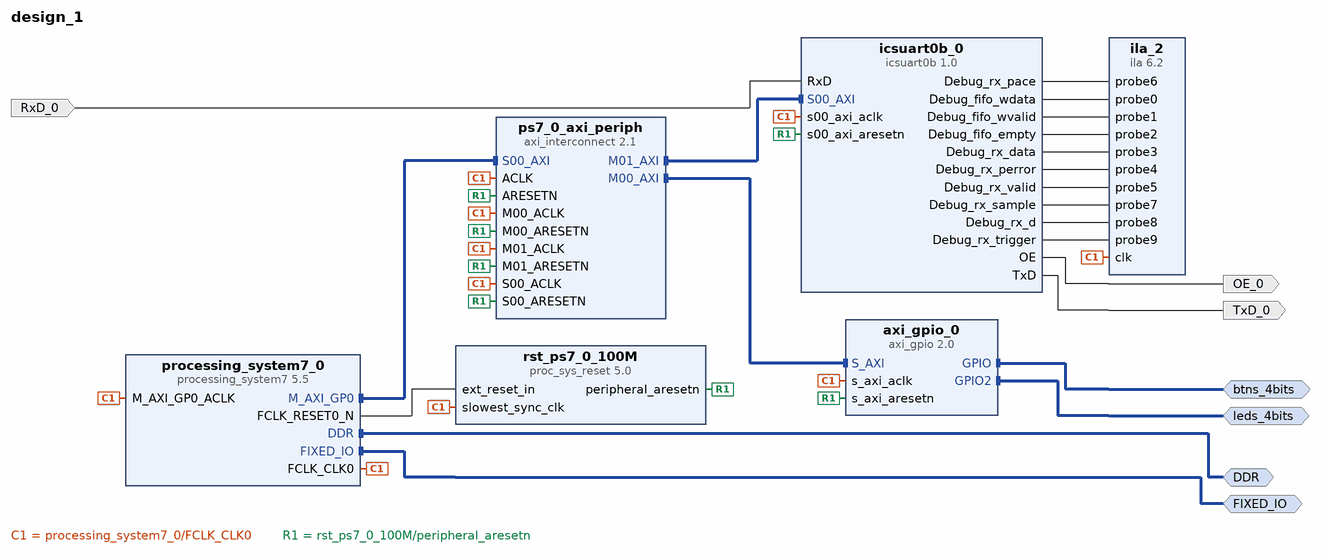
[diagram p0: block diagram of the top level]
# Vivado block design design_1, xc7z010clg400-1, Vivado 2018.3
create_bd_design design_1

create_bd_intf_port -mode Master -vlnv xilinx.com:interface:ddrx_rtl:1.0 DDR
create_bd_intf_port -mode Master -vlnv xilinx.com:display_processing_system7:fixedio_rtl:1.0 FIXED_IO
create_bd_intf_port -mode Master -vlnv xilinx.com:interface:gpio_rtl:1.0 btns_4bits
create_bd_intf_port -mode Master -vlnv xilinx.com:interface:gpio_rtl:1.0 leds_4bits
create_bd_port -dir O TxD_0
create_bd_port -dir O OE_0
create_bd_port -dir I RxD_0

create_bd_cell -type ip -vlnv xilinx.com:ip:processing_system7:5.5 processing_system7_0
set_property -dict [list \
  CONFIG.PCW_APU_PERIPHERAL_FREQMHZ 650 \
  CONFIG.PCW_CRYSTAL_PERIPHERAL_FREQMHZ 50.000000 \
  CONFIG.PCW_ENET0_ENET0_IO {MIO 16 .. 27} \
  CONFIG.PCW_ENET0_GRP_MDIO_ENABLE 1 \
  CONFIG.PCW_ENET0_GRP_MDIO_IO {MIO 52 .. 53} \
  CONFIG.PCW_ENET0_PERIPHERAL_ENABLE 1 \
  CONFIG.PCW_ENET0_RESET_ENABLE 0 \
  CONFIG.PCW_ENET_RESET_ENABLE 1 \
  CONFIG.PCW_ENET_RESET_SELECT {Share reset pin} \
  CONFIG.PCW_FPGA0_PERIPHERAL_FREQMHZ 100 \
  CONFIG.PCW_FPGA1_PERIPHERAL_FREQMHZ 50 \
  CONFIG.PCW_GP0_EN_MODIFIABLE_TXN 0 \
  CONFIG.PCW_GP1_EN_MODIFIABLE_TXN 0 \
  CONFIG.PCW_GPIO_MIO_GPIO_ENABLE 1 \
  CONFIG.PCW_GPIO_MIO_GPIO_IO MIO \
  CONFIG.PCW_I2C_RESET_ENABLE 1 \
  CONFIG.PCW_PERIPHERAL_BOARD_PRESET part0 \
  CONFIG.PCW_PRESET_BANK1_VOLTAGE {LVCMOS 1.8V} \
  CONFIG.PCW_QSPI_GRP_FBCLK_ENABLE 1 \
  CONFIG.PCW_QSPI_GRP_FBCLK_IO {MIO 8} \
  CONFIG.PCW_QSPI_GRP_SINGLE_SS_ENABLE 1 \
  CONFIG.PCW_QSPI_GRP_SINGLE_SS_IO {MIO 1 .. 6} \
  CONFIG.PCW_QSPI_PERIPHERAL_ENABLE 1 \
  CONFIG.PCW_QSPI_QSPI_IO {MIO 1 .. 6} \
  CONFIG.PCW_SD0_GRP_CD_ENABLE 1 \
  CONFIG.PCW_SD0_GRP_CD_IO {MIO 47} \
  CONFIG.PCW_SD0_GRP_WP_ENABLE 1 \
  CONFIG.PCW_SD0_GRP_WP_IO EMIO \
  CONFIG.PCW_SD0_PERIPHERAL_ENABLE 1 \
  CONFIG.PCW_SD0_SD0_IO {MIO 40 .. 45} \
  CONFIG.PCW_SDIO_PERIPHERAL_FREQMHZ 50 \
  CONFIG.PCW_SINGLE_QSPI_DATA_MODE x4 \
  CONFIG.PCW_TTC0_PERIPHERAL_ENABLE 1 \
  CONFIG.PCW_TTC0_TTC0_IO EMIO \
  CONFIG.PCW_UART1_PERIPHERAL_ENABLE 1 \
  CONFIG.PCW_UART1_UART1_IO {MIO 48 .. 49} \
  CONFIG.PCW_UART_PERIPHERAL_FREQMHZ 100 \
  CONFIG.PCW_UIPARAM_DDR_FREQ_MHZ 525 \
  CONFIG.PCW_UIPARAM_DDR_PARTNO {MT41K128M16 JT-125} \
  CONFIG.PCW_USB0_PERIPHERAL_ENABLE 1 \
  CONFIG.PCW_USB0_RESET_ENABLE 1 \
  CONFIG.PCW_USB0_RESET_IO {MIO 46} \
  CONFIG.PCW_USB0_USB0_IO {MIO 28 .. 39} \
  CONFIG.PCW_USB_RESET_ENABLE 1 \
  CONFIG.PCW_USB_RESET_SELECT {Share reset pin} \
] [get_bd_cells processing_system7_0]
# 499 more settings of processing_system7_0 are not shown: defaults, MIO pin electricals, DDR timing, and values the tool derives
create_bd_cell -type ip -vlnv xilinx.com:ip:axi_gpio:2.0 axi_gpio_0
set_property -dict [list \
  CONFIG.GPIO2_BOARD_INTERFACE leds_4bits \
  CONFIG.GPIO_BOARD_INTERFACE btns_4bits \
  CONFIG.USE_BOARD_FLOW true \
] [get_bd_cells axi_gpio_0]
create_bd_cell -type ip -vlnv xilinx.com:ip:axi_interconnect:2.1 ps7_0_axi_periph
set_property -dict {CONFIG.NUM_MI 2} [get_bd_cells ps7_0_axi_periph]
create_bd_cell -type ip -vlnv xilinx.com:ip:proc_sys_reset:5.0 rst_ps7_0_100M
create_bd_cell -type ip -vlnv xilinx.com:ip:ila:6.2 ila_2
set_property -dict [list \
  CONFIG.ALL_PROBE_SAME_MU_CNT 2 \
  CONFIG.C_ADV_TRIGGER true \
  CONFIG.C_DATA_DEPTH 8192 \
  CONFIG.C_ENABLE_ILA_AXI_MON false \
  CONFIG.C_EN_STRG_QUAL 1 \
  CONFIG.C_MONITOR_TYPE Native \
  CONFIG.C_NUM_OF_PROBES 10 \
  CONFIG.C_PROBE0_MU_CNT 2 \
  CONFIG.C_PROBE0_WIDTH 32 \
  CONFIG.C_PROBE1_MU_CNT 2 \
  CONFIG.C_PROBE2_MU_CNT 2 \
  CONFIG.C_PROBE3_MU_CNT 2 \
  CONFIG.C_PROBE3_WIDTH 8 \
  CONFIG.C_PROBE4_MU_CNT 2 \
  CONFIG.C_PROBE5_MU_CNT 2 \
  CONFIG.C_PROBE6_MU_CNT 2 \
  CONFIG.C_PROBE7_MU_CNT 2 \
  CONFIG.C_PROBE8_MU_CNT 2 \
] [get_bd_cells ila_2]
create_bd_cell -type ip -vlnv snowlantern.jp:user:icsuart0b:1.0 icsuart0b_0

# ---- connections ----

connect_bd_intf_net [get_bd_intf_ports DDR] [get_bd_intf_pins processing_system7_0/DDR]
connect_bd_intf_net [get_bd_intf_pins ps7_0_axi_periph/M01_AXI] [get_bd_intf_pins icsuart0b_0/S00_AXI]
connect_bd_intf_net [get_bd_intf_pins ps7_0_axi_periph/M00_AXI] [get_bd_intf_pins axi_gpio_0/S_AXI]
connect_bd_intf_net [get_bd_intf_pins processing_system7_0/M_AXI_GP0] [get_bd_intf_pins ps7_0_axi_periph/S00_AXI]
connect_bd_intf_net [get_bd_intf_ports btns_4bits] [get_bd_intf_pins axi_gpio_0/GPIO]
connect_bd_intf_net [get_bd_intf_ports FIXED_IO] [get_bd_intf_pins processing_system7_0/FIXED_IO]
connect_bd_intf_net [get_bd_intf_ports leds_4bits] [get_bd_intf_pins axi_gpio_0/GPIO2]
connect_bd_net [get_bd_pins processing_system7_0/FCLK_CLK0] \
  [get_bd_pins processing_system7_0/M_AXI_GP0_ACLK] [get_bd_pins ps7_0_axi_periph/S00_ACLK] \
  [get_bd_pins rst_ps7_0_100M/slowest_sync_clk] [get_bd_pins axi_gpio_0/s_axi_aclk] [get_bd_pins ps7_0_axi_periph/M00_ACLK] \
  [get_bd_pins ps7_0_axi_periph/ACLK] [get_bd_pins ps7_0_axi_periph/M01_ACLK] [get_bd_pins ila_2/clk] \
  [get_bd_pins icsuart0b_0/s00_axi_aclk]
connect_bd_net [get_bd_pins processing_system7_0/FCLK_RESET0_N] [get_bd_pins rst_ps7_0_100M/ext_reset_in]
connect_bd_net [get_bd_pins rst_ps7_0_100M/peripheral_aresetn] \
  [get_bd_pins ps7_0_axi_periph/S00_ARESETN] [get_bd_pins axi_gpio_0/s_axi_aresetn] \
  [get_bd_pins ps7_0_axi_periph/M00_ARESETN] [get_bd_pins ps7_0_axi_periph/ARESETN] \
  [get_bd_pins ps7_0_axi_periph/M01_ARESETN] [get_bd_pins icsuart0b_0/s00_axi_aresetn]
connect_bd_net [get_bd_pins icsuart0b_0/TxD] [get_bd_ports TxD_0]
connect_bd_net [get_bd_pins icsuart0b_0/OE] [get_bd_ports OE_0]
connect_bd_net -net RxD_0_1 [get_bd_ports RxD_0] [get_bd_pins icsuart0b_0/RxD]
connect_bd_net -net Debug_rx_pace [get_bd_pins icsuart0b_0/Debug_rx_pace] [get_bd_pins ila_2/probe6]
connect_bd_net -net Debug_fifo_wdata [get_bd_pins icsuart0b_0/Debug_fifo_wdata] [get_bd_pins ila_2/probe0]
connect_bd_net -net Debug_fifo_wvalid [get_bd_pins icsuart0b_0/Debug_fifo_wvalid] [get_bd_pins ila_2/probe1]
connect_bd_net -net Debug_fifo_empty [get_bd_pins icsuart0b_0/Debug_fifo_empty] [get_bd_pins ila_2/probe2]
connect_bd_net -net Debug_rx_data [get_bd_pins icsuart0b_0/Debug_rx_data] [get_bd_pins ila_2/probe3]
connect_bd_net -net Debug_rx_perror [get_bd_pins icsuart0b_0/Debug_rx_perror] [get_bd_pins ila_2/probe4]
connect_bd_net -net Debug_rx_valid [get_bd_pins icsuart0b_0/Debug_rx_valid] [get_bd_pins ila_2/probe5]
connect_bd_net -net Debug_rx_sample [get_bd_pins icsuart0b_0/Debug_rx_sample] [get_bd_pins ila_2/probe7]
connect_bd_net -net Debug_rx_d [get_bd_pins icsuart0b_0/Debug_rx_d] [get_bd_pins ila_2/probe8]
connect_bd_net -net icsuart0b_0_Debug_rx_trigger [get_bd_pins icsuart0b_0/Debug_rx_trigger] [get_bd_pins ila_2/probe9]
set_property HDL_ATTRIBUTE.DEBUG true [get_bd_nets Debug_rx_pace]
set_property HDL_ATTRIBUTE.MARK_DEBUG true [get_bd_nets Debug_rx_pace]
set_property HDL_ATTRIBUTE.DEBUG true [get_bd_nets Debug_fifo_wdata]
set_property HDL_ATTRIBUTE.MARK_DEBUG true [get_bd_nets Debug_fifo_wdata]
set_property HDL_ATTRIBUTE.DEBUG true [get_bd_nets Debug_fifo_wvalid]
set_property HDL_ATTRIBUTE.MARK_DEBUG true [get_bd_nets Debug_fifo_wvalid]
set_property HDL_ATTRIBUTE.DEBUG true [get_bd_nets Debug_fifo_empty]
set_property HDL_ATTRIBUTE.MARK_DEBUG true [get_bd_nets Debug_fifo_empty]
set_property HDL_ATTRIBUTE.DEBUG true [get_bd_nets Debug_rx_data]
set_property HDL_ATTRIBUTE.MARK_DEBUG true [get_bd_nets Debug_rx_data]
set_property HDL_ATTRIBUTE.DEBUG true [get_bd_nets Debug_rx_perror]
set_property HDL_ATTRIBUTE.MARK_DEBUG true [get_bd_nets Debug_rx_perror]
set_property HDL_ATTRIBUTE.DEBUG true [get_bd_nets Debug_rx_valid]
set_property HDL_ATTRIBUTE.MARK_DEBUG true [get_bd_nets Debug_rx_valid]
set_property HDL_ATTRIBUTE.DEBUG true [get_bd_nets Debug_rx_sample]
set_property HDL_ATTRIBUTE.MARK_DEBUG true [get_bd_nets Debug_rx_sample]
set_property HDL_ATTRIBUTE.DEBUG true [get_bd_nets Debug_rx_d]
set_property HDL_ATTRIBUTE.MARK_DEBUG true [get_bd_nets Debug_rx_d]
set_property HDL_ATTRIBUTE.DEBUG true [get_bd_nets icsuart0b_0_Debug_rx_trigger]
set_property HDL_ATTRIBUTE.MARK_DEBUG true [get_bd_nets icsuart0b_0_Debug_rx_trigger]

# ---- address map ----
assign_bd_address -offset 0x41200000 -range 64K -target_address_space [get_bd_addr_spaces processing_system7_0/Data] [get_bd_addr_segs axi_gpio_0/S_AXI/Reg]
assign_bd_address -offset 0x43C00000 -range 64K -target_address_space [get_bd_addr_spaces processing_system7_0/Data] [get_bd_addr_segs icsuart0b_0/S00_AXI/S00_AXI_reg]

validate_bd_design
save_bd_design
